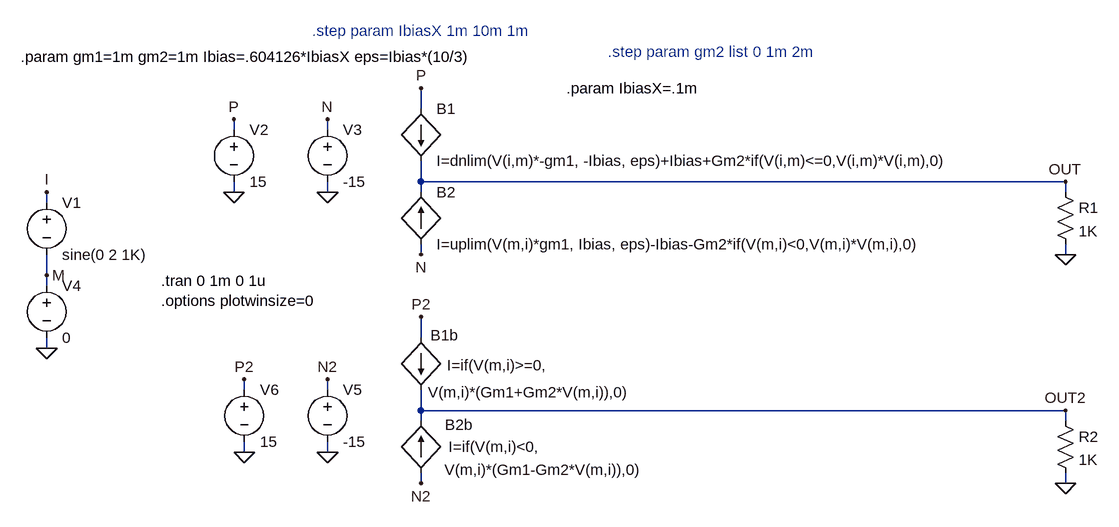
[diagram p0: schematic builtin_08_MicroCode.asc]
builtin_08_MicroCode.asc, the LTspice schematic file:
Version 4
SHEET 1 1564 796
WIRE 336 144 336 112
WIRE 48 176 48 160
WIRE 192 176 192 160
WIRE 336 256 336 224
WIRE 1328 256 336 256
WIRE 48 272 48 256
WIRE 192 272 192 256
WIRE 336 272 336 256
WIRE 1328 272 1328 256
WIRE -240 288 -240 272
WIRE 336 368 336 352
WIRE 1328 368 1328 352
WIRE -240 400 -240 368
WIRE -240 416 -240 400
WIRE 336 496 336 464
WIRE -240 512 -240 496
WIRE 64 576 64 560
WIRE 192 576 192 560
WIRE 336 608 336 576
WIRE 1328 608 336 608
WIRE 336 624 336 608
WIRE 1328 624 1328 608
WIRE 64 672 64 656
WIRE 192 672 192 656
WIRE 336 720 336 704
WIRE 1328 720 1328 704
FLAG -240 272 I
FLAG 48 272 0
FLAG 192 272 0
FLAG 1328 368 0
FLAG 336 112 P
FLAG 1328 256 OUT
FLAG 48 160 P
FLAG 192 160 N
FLAG 336 368 N
FLAG -240 512 0
FLAG -240 400 M
FLAG 1328 720 0
FLAG 336 464 P2
FLAG 1328 608 OUT2
FLAG 336 720 N2
FLAG 192 672 0
FLAG 192 560 N2
FLAG 64 672 0
FLAG 64 560 P2
SYMBOL bi 336 352 M180
WINDOW 0 24 80 Left 2
WINDOW 3 24 0 Left 2
SYMATTR InstName B2
SYMATTR Value I=uplim(V(m,i)*gm1, Ibias, eps)-Ibias-Gm2*if(V(m,i)<0,V(m,i)*V(m,i),0)
SYMBOL voltage -240 272 R0
SYMATTR InstName V1
SYMATTR Value sine(0 2 1K)
SYMBOL voltage 48 160 R0
SYMATTR InstName V2
SYMATTR Value 15
SYMBOL voltage 192 160 R0
SYMATTR InstName V3
SYMATTR Value -15
SYMBOL bi 336 144 R0
SYMATTR InstName B1
SYMATTR Value I=dnlim(V(i,m)*-gm1, -Ibias, eps)+Ibias+Gm2*if(V(i,m)<=0,V(i,m)*V(i,m),0)
SYMBOL res 1312 256 R0
SYMATTR InstName R1
SYMATTR Value 1K
SYMBOL voltage -240 400 R0
SYMATTR InstName V4
SYMATTR Value 0
SYMBOL res 1312 608 R0
SYMATTR InstName R2
SYMATTR Value 1K
SYMBOL bi 336 496 R0
WINDOW 3 40 42 Left 2
WINDOW 123 11 84 Left 2
WINDOW 0 15 -4 Left 2
SYMATTR Value I=if(V(m,i)>=0,
SYMATTR Value2 V(m,i)*(Gm1+Gm2*V(m,i)),0)
SYMATTR InstName B1b
SYMBOL bi 336 704 M180
WINDOW 3 42 40 Left 2
WINDOW 123 36 5 Left 2
WINDOW 0 37 74 Left 2
SYMATTR Value I=if(V(m,i)<0,
SYMATTR Value2 V(m,i)*(Gm1-Gm2*V(m,i)),0)
SYMATTR InstName B2b
SYMBOL voltage 192 560 R0
SYMATTR InstName V5
SYMATTR Value -15
SYMBOL voltage 64 560 R0
SYMATTR InstName V6
SYMATTR Value 15
TEXT -64 408 Left 2 !.tran 0 1m 0 1u\n.options plotwinsize=0
TEXT 168 24 Left 2 ;.step param IbiasX 1m 10m 1m
TEXT -280 64 Left 2 !.param gm1=1m gm2=1m Ibias=.604126*IbiasX eps=Ibias*(10/3)
TEXT 560 112 Left 2 !.param IbiasX=.1m
TEXT 624 56 Left 2 ;.step param gm2 list 0 1m 2m

The netlist it stands for:
* builtin_08_MicroCode.asc
B2 N OUT I=uplim(V(m,i)*gm1, Ibias, eps)-Ibias-Gm2*if(V(m,i)<0,V(m,i)*V(m,i),0)
V1 I M sine(0 2 1K)
V2 P 0 15
V3 N 0 -15
B1 P OUT I=dnlim(V(i,m)*-gm1, -Ibias, eps)+Ibias+Gm2*if(V(i,m)<=0,V(i,m)*V(i,m),0)
R1 OUT 0 1K
V4 M 0 0
R2 OUT2 0 1K
B1b P2 OUT2 I=if(V(m,i)>=0, V(m,i)*(Gm1+Gm2*V(m,i)),0)
B2b N2 OUT2 I=if(V(m,i)<0, V(m,i)*(Gm1-Gm2*V(m,i)),0)
V5 N2 0 -15
V6 P2 0 15
.tran 0 1m 0 1u
.options plotwinsize=0
* .step param IbiasX 1m 10m 1m
.param gm1=1m gm2=1m Ibias=.604126*IbiasX eps=Ibias*(10/3)
.param IbiasX=.1m
* .step param gm2 list 0 1m 2m
.backanno
.end